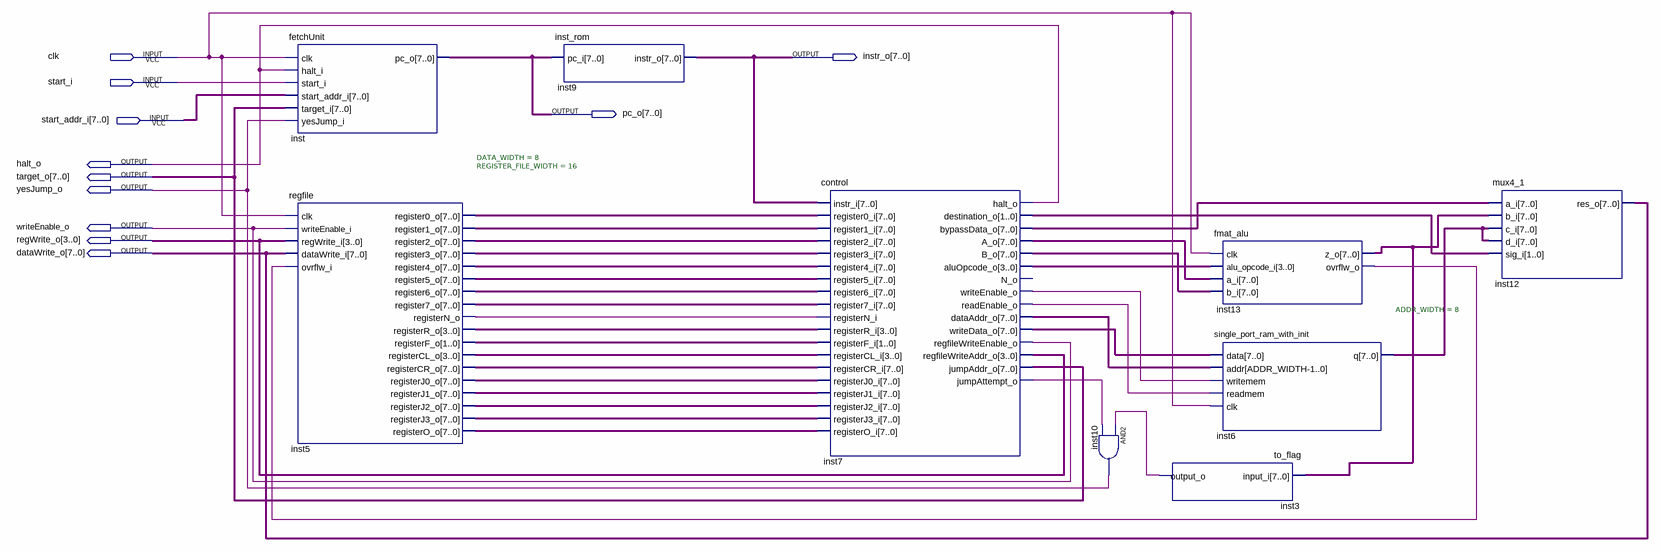
[diagram p0: schematic sheet]
// Quartus schematic p2.bdf as structural Verilog: 9 symbols, 11 pins
module p2 (
  input  clk,
  input  start_i,
  input  [7:0] start_addr_i,
  output [7:0] instr_o,
  output [7:0] pc_o,
  output halt_o,
  output [7:0] target_o,
  output yesJump_o,
  output writeEnable_o,
  output [3:0] regWrite_o,
  output [7:0] dataWrite_o
);

  wire inst3_output_o, inst5_registern_o, inst7_jumpattempt_o, inst7_readenable_o, inst7_writeenable_o,
       inst13_ovrflw_o;
  wire [1:0] inst5_registerf_o, inst7_destination_o;
  wire [3:0] inst5_registercl_o, inst5_registerr_o, inst7_aluopcode_o;
  wire [7:0] inst5_register0_o, inst5_register1_o, inst5_register2_o, inst5_register3_o, inst5_register4_o,
       inst5_register5_o, inst5_register6_o, inst5_register7_o, inst5_registercr_o, inst5_registerj0_o,
       inst5_registerj1_o, inst5_registerj2_o, inst5_registerj3_o, inst5_registero_o, inst6_q, inst7_a_o,
       inst7_b_o, inst7_bypassdata_o, inst7_dataaddr_o, inst7_writedata_o, inst13_z_o;

  fetchUnit inst (
    .clk(clk), .halt_i(halt_o), .start_i(start_i), .start_addr_i(start_addr_i), .target_i(target_o),
    .yesJump_i(yesJump_o), .pc_o(pc_o));
  regfile #(.DATA_WIDTH(8), .REGISTER_FILE_WIDTH(16)) inst5 (
    .clk(clk), .writeEnable_i(writeEnable_o), .regWrite_i(regWrite_o), .dataWrite_i(dataWrite_o),
    .ovrflw_i(inst13_ovrflw_o), .register0_o(inst5_register0_o), .register1_o(inst5_register1_o),
    .register2_o(inst5_register2_o), .register3_o(inst5_register3_o), .register4_o(inst5_register4_o),
    .register5_o(inst5_register5_o), .register6_o(inst5_register6_o), .register7_o(inst5_register7_o),
    .registerN_o(inst5_registern_o), .registerR_o(inst5_registerr_o), .registerF_o(inst5_registerf_o),
    .registerCL_o(inst5_registercl_o), .registerCR_o(inst5_registercr_o), .registerJ0_o(inst5_registerj0_o),
    .registerJ1_o(inst5_registerj1_o), .registerJ2_o(inst5_registerj2_o), .registerJ3_o(inst5_registerj3_o),
    .registerO_o(inst5_registero_o));
  inst_rom inst9 (.pc_i(pc_o), .instr_o(instr_o));
  control inst7 (
    .instr_i(instr_o), .register0_i(inst5_register0_o), .register1_i(inst5_register1_o),
    .register2_i(inst5_register2_o), .register3_i(inst5_register3_o), .register4_i(inst5_register4_o),
    .register5_i(inst5_register5_o), .register6_i(inst5_register6_o), .register7_i(inst5_register7_o),
    .registerN_i(inst5_registern_o), .registerR_i(inst5_registerr_o), .registerF_i(inst5_registerf_o),
    .registerCL_i(inst5_registercl_o), .registerCR_i(inst5_registercr_o), .registerJ0_i(inst5_registerj0_o),
    .registerJ1_i(inst5_registerj1_o), .registerJ2_i(inst5_registerj2_o), .registerJ3_i(inst5_registerj3_o),
    .registerO_i(inst5_registero_o), .halt_o(halt_o), .destination_o(inst7_destination_o),
    .bypassData_o(inst7_bypassdata_o), .A_o(inst7_a_o), .B_o(inst7_b_o), .aluOpcode_o(inst7_aluopcode_o),
    .writeEnable_o(inst7_writeenable_o), .readEnable_o(inst7_readenable_o), .dataAddr_o(inst7_dataaddr_o),
    .writeData_o(inst7_writedata_o), .regfileWriteEnable_o(writeEnable_o), .regfileWriteAddr_o(regWrite_o),
    .jumpAddr_o(target_o), .jumpAttempt_o(inst7_jumpattempt_o));  // open: N_o
  and inst10 (yesJump_o, inst3_output_o, inst7_jumpattempt_o);
  to_flag inst3 (.input_i(inst13_z_o), .output_o(inst3_output_o));
  fmat_alu inst13 (
    .clk(clk), .alu_opcode_i(inst7_aluopcode_o), .a_i(inst7_a_o), .b_i(inst7_b_o), .z_o(inst13_z_o),
    .ovrflw_o(inst13_ovrflw_o));
  single_port_ram_with_init #(.ADDR_WIDTH(8)) inst6 (
    .data(inst7_writedata_o), .addr(inst7_dataaddr_o), .writemem(inst7_writeenable_o),
    .readmem(inst7_readenable_o), .clk(clk), .q(inst6_q));
  mux4_1 inst12 (
    .a_i(inst7_bypassdata_o), .b_i(inst13_z_o), .c_i(inst6_q), .d_i(inst6_q), .sig_i(inst7_destination_o),
    .res_o(dataWrite_o));
endmodule
